# Altium schematic sheet DC-DC_Isolation.SchDoc
size A2; SheetNumber: 1; SheetTotal: 1; SPICEModelCacheUJGLTUQW: <root> / <DocumentId>UJGLTUQW</DocumentId> / <CacheFrame Number="0"> / <Model Name="7850_744775239_390u" Kind="CKT"> / <Text>******* / .subckt 7850_744775239_390u 1 2 / Rp 1 2 180000 / Cp 1 2 5p / Rs 1 N3 1.151 / L1 N3 2 390u / .ends 7850_744775239_390u</Text> / </Model> / </CacheFrame> / </root>
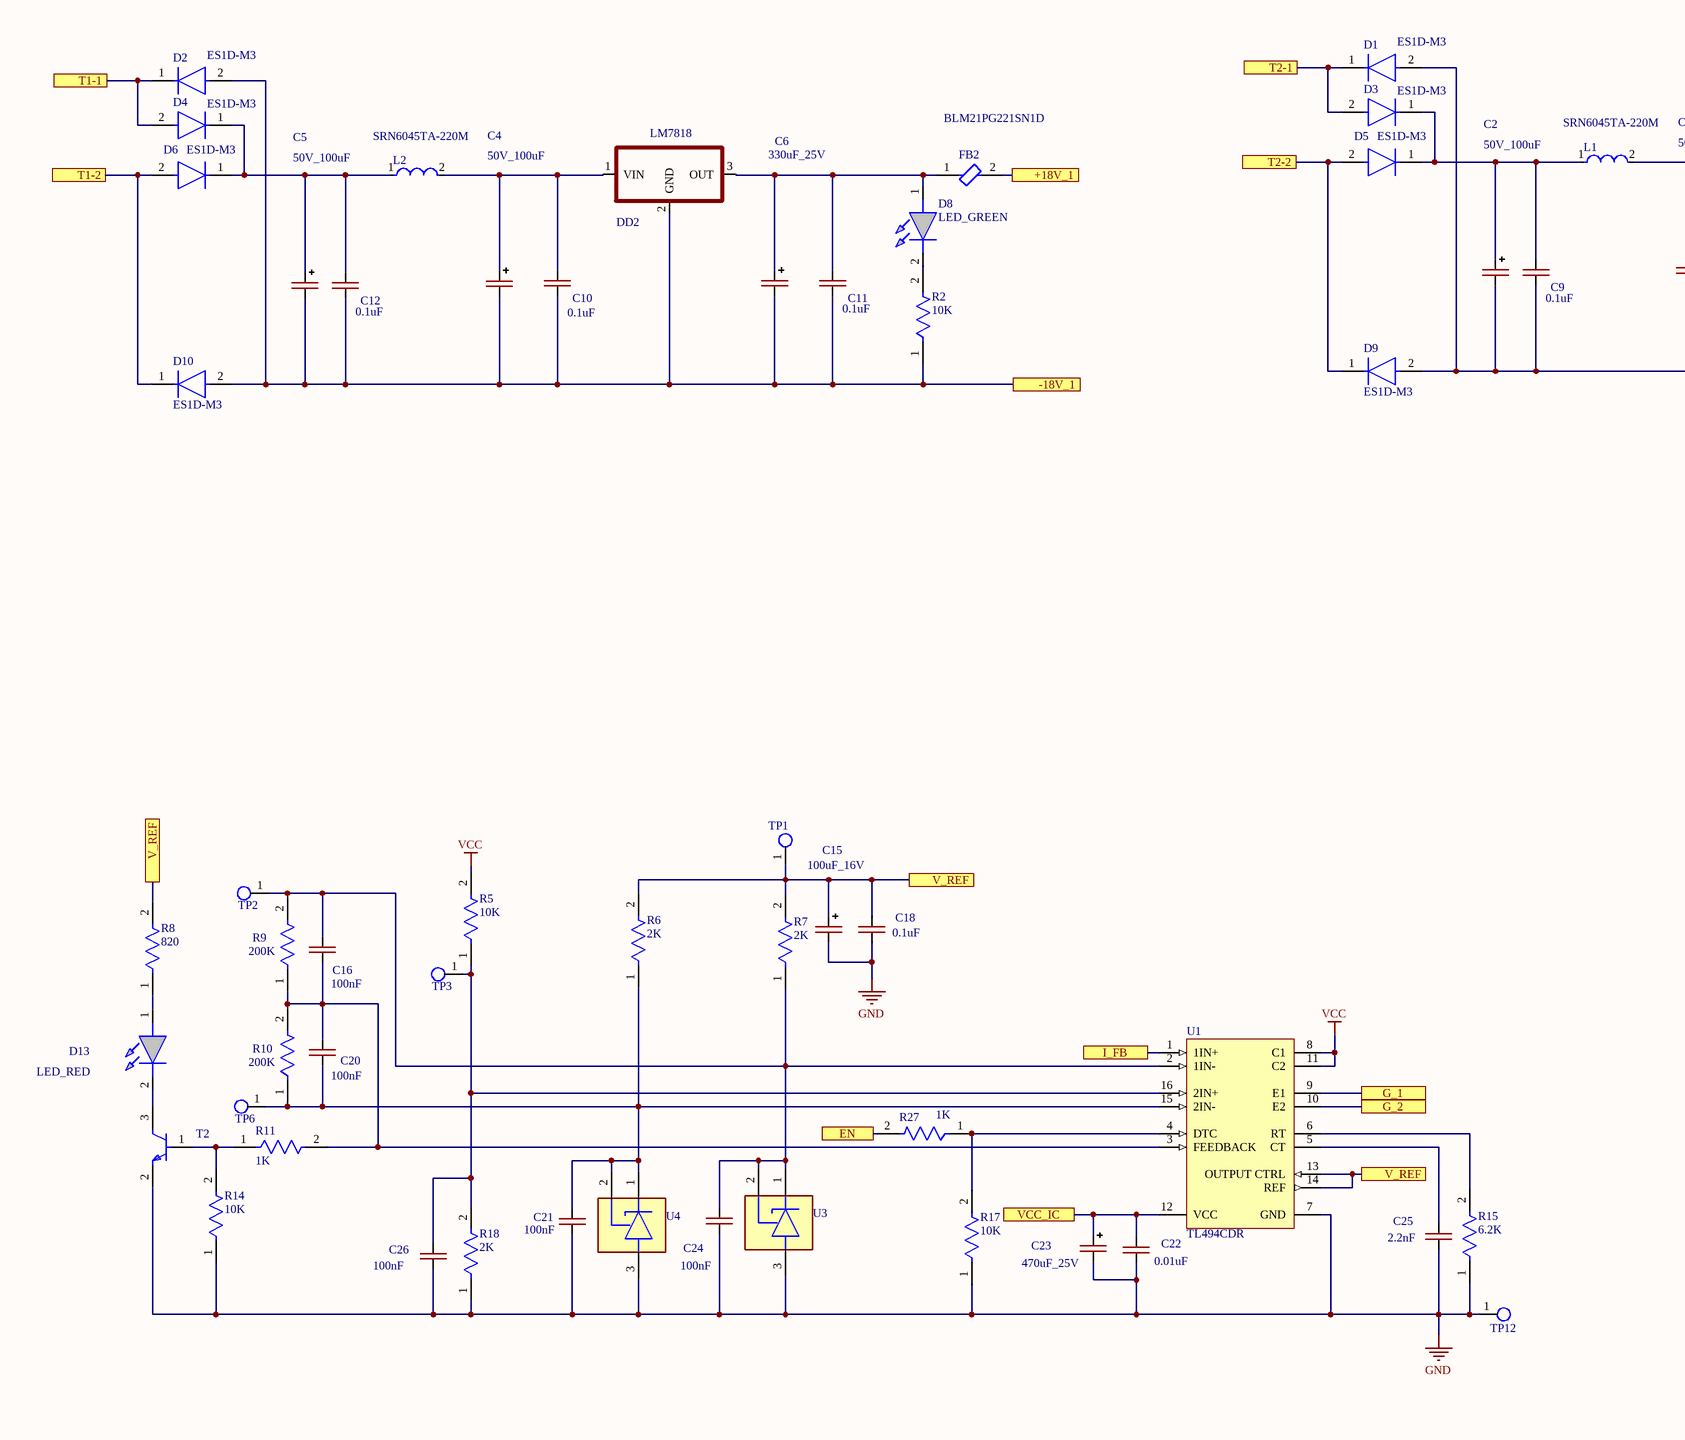
[diagram p0: DC-DC_Isolation.SchDoc, left]
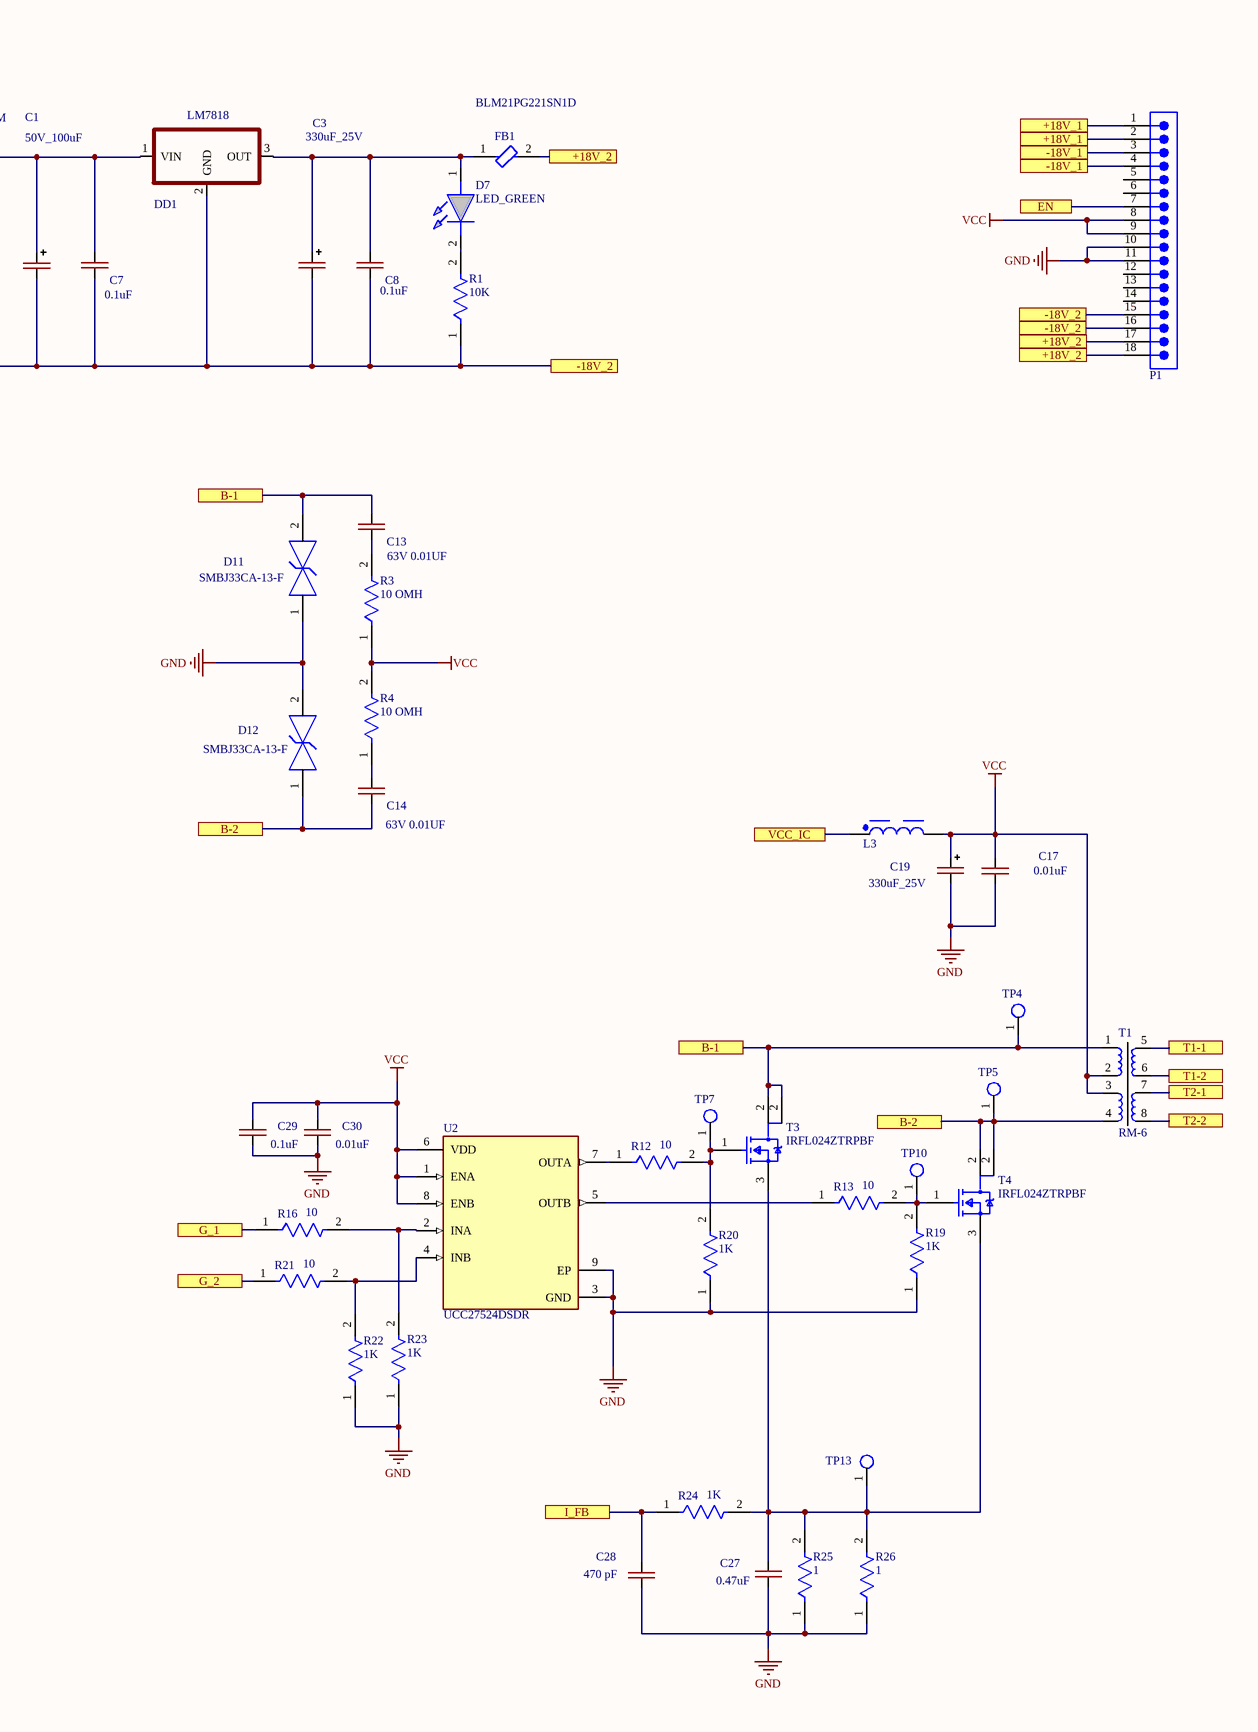
[diagram p1: DC-DC_Isolation.SchDoc, right]

## Parts
C1  50V_100uF  [CAP_SMD_Size_G]
C2  50V_100uF  [CAP_SMD_Size_G]
C3  330uF_25V  [CAP_SMD_Size_G]
C4  50V_100uF  [CAP_SMD_Size_G]
C5  50V_100uF  [CAP_SMD_Size_G]
C6  330uF_25V  [CAP_SMD_Size_G]
C7  0.1uF  [CAP-0805]
C8  0.1uF  [CAP-0805]
C9  0.1uF  [CAP-0805]
C10  0.1uF  [CAP-0805]
C11  0.1uF  [CAP-0805]
C12  0.1uF  [CAP-0805]
C13  63V 0.01UF  [FKP2D011001A00JSSD]
C14  63V 0.01UF  [FKP2D011001A00JSSD]
C15  100uF_16V  [CAP-TAN-D]
C16  100nF  [CAP-0603]
C17  0.01uF  [CAP-0805]
C18  0.1uF  [CAP-0603]
C19  330uF_25V  [CAP_SMD_Size_G]
C20  100nF  [CAP-0603]
C21  100nF  [CAP-0603]
C22  0.01uF  [CAP-0603]
C23  470uF_25V  [CAP_SMD_Size_G]
C24  100nF  [CAP-0603]
C25  2.2nF  [CAP-0603]
C26  100nF  [CAP-0805]
C27  0.47uF  [CAP-0603]
C28  470 pF  [CAP-0603]
C29  0.1uF  [CAP-0603]
C30  0.01uF  [CAP-0603]
D1  ES1D-M3  [FP-SMA-MFG]
D2  ES1D-M3  [FP-SMA-MFG]
D3  ES1D-M3  [FP-SMA-MFG]
D4  ES1D-M3  [FP-SMA-MFG]
D5  ES1D-M3  [FP-SMA-MFG]
D6  ES1D-M3  [FP-SMA-MFG]
D7  LED_GREEN  [LED_GREEN]
D8  LED_GREEN  [LED_GREEN]
D9  ES1D-M3  [FP-SMA-MFG]
D10  ES1D-M3  [FP-SMA-MFG]
D11  SMBJ33CA-13-F  [FP-SMB-CA-MFG]
D12  SMBJ33CA-13-F  [FP-SMB-CA-MFG]
D13  LED_RED  [LED_RED]
DD1  LM7818  [TO-252]  (value not drawn)
DD2  LM7818  [TO-252]  (value not drawn)
FB1  BLM21PG221SN1D  [FP-BLM21-0_2-t0_85-e0_5-IPC_B]
FB2  BLM21PG221SN1D  [FP-BLM21-0_2-t0_85-e0_5-IPC_B]
L1  SRN6045TA-220M  [FP-SRN6045TA-MFG]
L2  SRN6045TA-220M  [FP-SRN6045TA-MFG]
L3  330µH, 0.38A  [WE-PD2_7850]  (value not drawn)
P1  61301811021  [61301811021]  (value not drawn)
R1  10K  [RES-0805]
R2  10K  [RES-0805]
R3  10 OMH  [RES-1206]
R4  10 OMH  [RES-1206]
R5  10K  [RES-0603]
R6  2K  [RES-0603]
R7  2K  [RES-0603]
R8  820  [RES-0603]
R9  200K  [RES-0603]
R10  200K  [RES-0603]
R11  1K  [RES-0603]
R12  10  [RES-0805]
R13  10  [RES-0805]
R14  10K  [RES-0603]
R15  6.2K  [RES-0603]
R16  10  [RES-0603]
R17  10K  [RES-0603]
R18  2K  [RES-0603]
R19  1K  [RES-0603]
R20  1K  [RES-0603]
R21  10  [RES-0603]
R22  1K  [RES-0603]
R23  1K  [RES-0603]
R24  1K  [RES-0603]
R25  1  [RES-2512]
R26  1  [RES-2512]
R27  1K  [RES-0603]
T1  RM-6  [TRANS_RM6]
T2  BC847C  [SOT23-3_IPC_A]  (value not drawn)
T3  IRFL024ZTRPBF  [SOT-223-3]
T4  IRFL024ZTRPBF  [SOT-223-3]
TP1  Test_Point_PCB  [Test_Point]  (value not drawn)
TP2  Test_Point_PCB  [Test_Point]  (value not drawn)
TP3  Test_Point_PCB  [Test_Point]  (value not drawn)
TP4  (no value)  [Test_Point]
TP5  (no value)  [Test_Point]
TP6  (no value)  [Test_Point]
TP7  (no value)  [Test_Point]
TP10  (no value)  [Test_Point]
TP12  (no value)  [Test_Point]
TP13  (no value)  [Test_Point]
U1  TL494CDR  [D0016A_N]
U2  UCC27524DSDR  [FP-DSD0008D-IPC_A]
U3  TL431  [TL431_SOT-23-3(A)]  (value not drawn)
U4  TL431  [TL431_SOT-23-3(A)]  (value not drawn)

## Ports
+18V_1, +18V_2, -18V_1, -18V_2, B-1, B-2, EN, G_1, G_2, I_FB, T1-1, T1-2, T2-1, T2-2, V_REF, VCC_IC

## Nets
GND: C15.2(-) C17.1 C18.1 C19.2(-) C21.1 C22.1 C23.2(-) C24.1 C25.1 C26.1 C27.1 C28.1 C29.1 C30.1 D11.1 D12.2 P1.10 P1.11 R14.1 R15.1 R17.1 R18.1 R19.1 R20.1 R22.1 R23.1 R25.1 R26.1 T2.2(E) TP12.1(G9) U1.7(GND) U2.3(GND) U2.9(EP) U3.3(A) U4.3(A)
VCC: C17.2 C19.1(+) C29.2 C30.2 L3.2 P1.8 P1.9 R3.1 R4.2 R5.2 T1.2 T1.3 U1.8(C1) U1.11(C2) U2.1(ENA) U2.6(VDD) U2.8(ENB)
+18V_1: FB2.2 P1.1 P1.2 ; port +18V_1
+18V_2: FB1.2 P1.17 P1.18 ; port +18V_2
-18V_1: C4.2(-) C5.2(-) C6.2(-) C10.1 C11.1 C12.1 D2.2(A) D10.2(A) DD2.2(GND) P1.3 P1.4 R2.1 ; port -18V_1
-18V_2: C1.2(-) C2.2(-) C3.2(-) C7.1 C8.1 C9.1 D1.2(A) D9.2(A) DD1.2(GND) P1.15 P1.16 R1.1 ; port -18V_2
B-1: C13.2 D11.2 T1.1 T3.2(DRAIN) TP4.1(G9) ; port B-1
B-2: C14.2 D12.1 T1.4 T4.2(DRAIN) TP5.1(G9) ; port B-2
EN: P1.7 R27.2 ; port EN
G_1: R16.1 U1.9(E1) ; port G_1
G_2: R21.1 U1.10(E2) ; port G_2
I_FB: C28.2 R24.1 U1.1(1IN+) ; port I_FB
T1-1: D2.1(C) D4.2(A) T1.5 ; port T1-1
T1-2: D6.2(A) D10.1(C) T1.6 ; port T1-2
T2-1: D1.1(C) D3.2(A) T1.7 ; port T2-1
T2-2: D5.2(A) D9.1(C) T1.8 ; port T2-2
V_REF: C15.1(+) C18.2 R6.2 R7.2 R8.2 TP1.1(G9) U1.13(OUTPUT_CTRL) U1.14(REF) ; port V_REF
VCC_IC: C22.2 C23.1(+) L3.1 U1.12(VCC) ; port VCC_IC
NetC1_1: C1.1(+) C7.2 DD1.1(VIN) L1.2
NetC2_1: C2.1(+) C9.2 D3.1(C) D5.1(C) L1.1
NetC3_1: C3.1(+) C8.2 D7.1(A) DD1.3(OUT) FB1.1
NetC4_1: C4.1(+) C10.2 DD2.1(VIN) L2.2
NetC5_1: C5.1(+) C12.2 D4.1(C) D6.1(C) L2.1
NetC6_1: C6.1(+) C11.2 D8.1(A) DD2.3(OUT) FB2.1
NetC13_1: C13.1 R3.2
NetC14_1: C14.1 R4.1
NetC16_1: C16.1 C20.2 R9.1 R10.2 R11.2 U1.3(FEEDBACK)
NetC16_2: C16.2 C24.2 R7.1 R9.2 TP2.1(G9) U1.2(1IN-) U3.1(C) U3.2(REF)
NetC20_1: C20.1 C21.2 R6.1 R10.1 TP6.1(G9) U1.15(2IN-) U4.1(C) U4.2(REF)
NetC25_2: C25.2 U1.5(CT)
NetC26_2: C26.2 R5.1 R18.2 TP3.1(G9) U1.16(2IN+)
NetC27_2: C27.2 R24.2 R25.2 R26.2 T3.3(SOURCE) T4.3(SOURCE) TP13.1(G9)
NetD7_2: D7.2(K) R1.2
NetD8_2: D8.2(K) R2.2
NetD13_1: D13.1(A) R8.1
NetD13_2: D13.2(K) T2.3(C)
NetR11_1: R11.1 R14.2 T2.1(B)
NetR12_1: R12.1 U2.7(OUTA)
NetR12_2: R12.2 R20.2 T3.1(GATE) TP7.1(G9)
NetR13_1: R13.1 U2.5(OUTB)
NetR13_2: R13.2 R19.2 T4.1(GATE) TP10.1(G9)
NetR15_2: R15.2 U1.6(RT)
NetR16_2: R16.2 R23.2 U2.2(INA)
NetR17_2: R17.2 R27.1 U1.4(DTC)
NetR21_2: R21.2 R22.2 U2.4(INB)

Not connected (* = marked no-connect by the designer): P1 5 6 12 13 14

## Library data of the parts
C1-C6 C15 C19 C23 = CAP-POLAR
C7 C9 C10 C12 = CAP-NON-POLAR: 0.1uF X7R
C8 C11 C16-C18 C20-C22 C24-C30 = CAP-NON-POLAR
C13 C14 = CAP-NON-POLAR: WIMA Film Capacitor FKP2 63V 0.01UF
D7 D8 D13 = LED: Manufacturer_Name: Wurth Elektronik; Manufacturer_Part_Number: 151031YS06000; Geometry.Height: 5.5mm; Mouser Part Number: 710-151031YS06000; Mouser Price/Stock: https://www.mouser.co.uk/ProductDetail/Wurth-Elektronik/151031YS06000?qs=LlUlMxKIyB3xSYYW%252BcuBiQ%3D%3D; Arrow Part Number: *; Arrow Price/Stock: *; Mouser Testing Part Number: *; Mouser Testing Price/Stock: *; Datasheet Link: https://katalog.we-online.de/led/datasheet/151031YS06000.pdf
D11 D12 = SMBJ33CA-13-F: TVS DIODE 33V 53.3V SMB
FB1 FB2 = CMP-0686-00610-3: Chip Ferrite Bead, 0805, 220Ω @ 100MHz, 0.045Ω, 25%, 2A; Number of Circuits: 1; Shielding: Unshielded; DC Resistance (DCR): 45mR; Impedance: 220R; Radiation Hardening: No; Material: Ferrite; Frequency: 100MHz; Width: 1.25mm; DC Current: 2A; Max DC Current: 2A; Number of Lines: 1; Package Quantity: 1; Case Code (Metric): 2012; Current Rating: 2A; Case/Package: 0805; Current: 2A; Military Standard: Not; Core Material: Ferrite; Depth: 1.25mm; Contact Plating: Tin; DC Resistance-Max: 45mR; Max Operating Temperature: 125°C; Length: 2mm; Max Current Rating: 2A; REACH SVHC: No SVHC; Termination: SMD/SMT; Min Operating Temperature: -55°C; Series: BLM21P; Test Frequency: 100MHz; Tolerance: 25%; Number of Pins: 2; RoHS Compliant: Yes; Height: 0.85mm; Packaging: Tape and Reel; Lead Free: Lead Free; Case Code (Imperial): 0805
L1 L2 = CMP-07248-000061-1: FIXED IND 22UH 2.3A 96 MOHM SMD; DC Resistance (DCR): 96mR; Saturation Current: 3.3A; Inductance Tolerance: 20%; RoHS Compliant: Yes; Packaging: Cut Tape; Inductance: 22uH; RMS Current (Irms): 2.3A; REACH SVHC: No SVHC; Mount: Surface Mount
L3 = 744775239: WE-PD2 SMT Power Inductor, size 7850, 390µH, 0.38A, 1.77Ω; Manufacturer: Wurth Elektronik; Case/Size Code: 7850; DC Resistance: 1.151Ω; Saturation Current: 0.43A; Self Resonant Frequency: 3.9MHz; Manufacturer Part Number: 744775239; Category: Unshielded Power Inductors; Match Code: WE-PD2; ComponentLink1Description: Website Link; ComponentLink1URL: https://www.we-online.com/redexpert/article/744775239?ad; ComponentLink2Description: Datasheet Link; ComponentLink2URL: https://www.we-online.com/redexpert/spec/744775239?ad; Mount: Surface Mount; Operating Temperature Max: 125°C; Operating Temperature Min: -40°C; Packaging: Tape and Reel; Length: 7.8mm; Width: 7mm; Height: 4.95mm; DC Resistance Max: 1.77Ω; Inductance: 390µH; Rated Current: 0.38A
P1 = 61301811021: WR-PHD Pin Header, THT, Angled, pitch 2.54mm, 1 Row, 18P; Manufacturer: Wurth Elektronik; Contact Resistance: 20mOhm; Rated Current: 3A; Working Voltage: 250V; Withstanding Voltage: 500V; Manufacturer Part Number: 61301811021; Category: Board-to-Board Connectors; Match Code: WR-PHD; ComponentLink1Description: Website Link; ComponentLink1URL: https://www.we-online.com/redexpert/article/61301811021?ad; ComponentLink2Description: Datasheet Link; ComponentLink2URL: https://www.we-online.com/redexpert/spec/61301811021?ad; Mount: Through Hole; Operating Temperature Max: 105°C; Operating Temperature Min: -40°C; Packaging: Bag; Gender: Pin Header; Number of Pins: 18; Number of Rows: 1; Orientation: Angled; Pitch: 2.54mm
R1-R27 = RES-CONST
T1 = RM_6_12-12-18-18
TP1-TP7 TP10 TP12 TP13 = TP_PCB?: Test_Point
U1 = CMP-0319-00950-2: Pulse-Width-Modulation Control Circuit with Voltage Control, 45 % Duty Cycle, 0 to +70 degC, 16-pin SOIC (D), Green (RoHS & no Sb/Br); Manufacturer: Texas Instruments; Regulated Outputs(#): 2; Frequency(Max)(kHz): 300; Topology: Boost, Buck, Flyback, Forward, Full-Bridge, Half-Bridge, Push-Pull; SubFamily: PWM Controller; Duty Cycle(Max)(%): 45; Rating: Military; PackageDescription: 16-Pin Plastic Small Outline Integrated Circuit, 9.9 x 3.9 mm, Pitch 1.27 mm Pitch; Mounting Technology: Surface Mount; PackageReference: D0016A; DatasheetVersion: SLVS074E; Control Method: Voltage; ComponentLink1Description: Datasheet; ComponentLink1URL: http://www.ti.com/general/docs/lit/getliterature.tsp?genericPartNumber=TL494&fileType=pdf; Code_JEDEC: MS-012AC; Eco-Plan: Green (RoHS & no Sb/Br); PackageVersion: revM, Jun-2011; PartNumber: TL494CDR
U2 = UCC27524DSDR: IC GATE DVR LO-SIDE DL 5A 8SON
U3 U4 = TL431_SOT-23-3